# Altium schematic sheet PWM_Controller_Full_Bridge_TL494.SchDoc
size A0; SPICEModelCacheYQEDCYZF: <root> / <DocumentId>YQEDCYZF</DocumentId> / <CacheFrame Number="0"> / <Model Name="7850_744775147_47u" Kind="CKT"> / <Text>******* / .subckt 7850_744775147_47u 1 2 / Rp 1 2 40000 / Cp 1 2 4p / Rs 1 N3 0.1343 / L1 N3 2 47u / .ends 7850_744775147_47u</Text> / </Model> / <Model Name="7850_74477530_1m" Kind="CKT"> / <Text>******* / .subckt 7850_74477530_1m 1 2 / Rp 1 2 187304.915771 / Cp 1 2 4.36976277949p / Rs 1 N3 3.3 / L1 N3 2 1000u / .ends 7850_74477530_1m</Text> / </Model> / </CacheFrame> / </root>
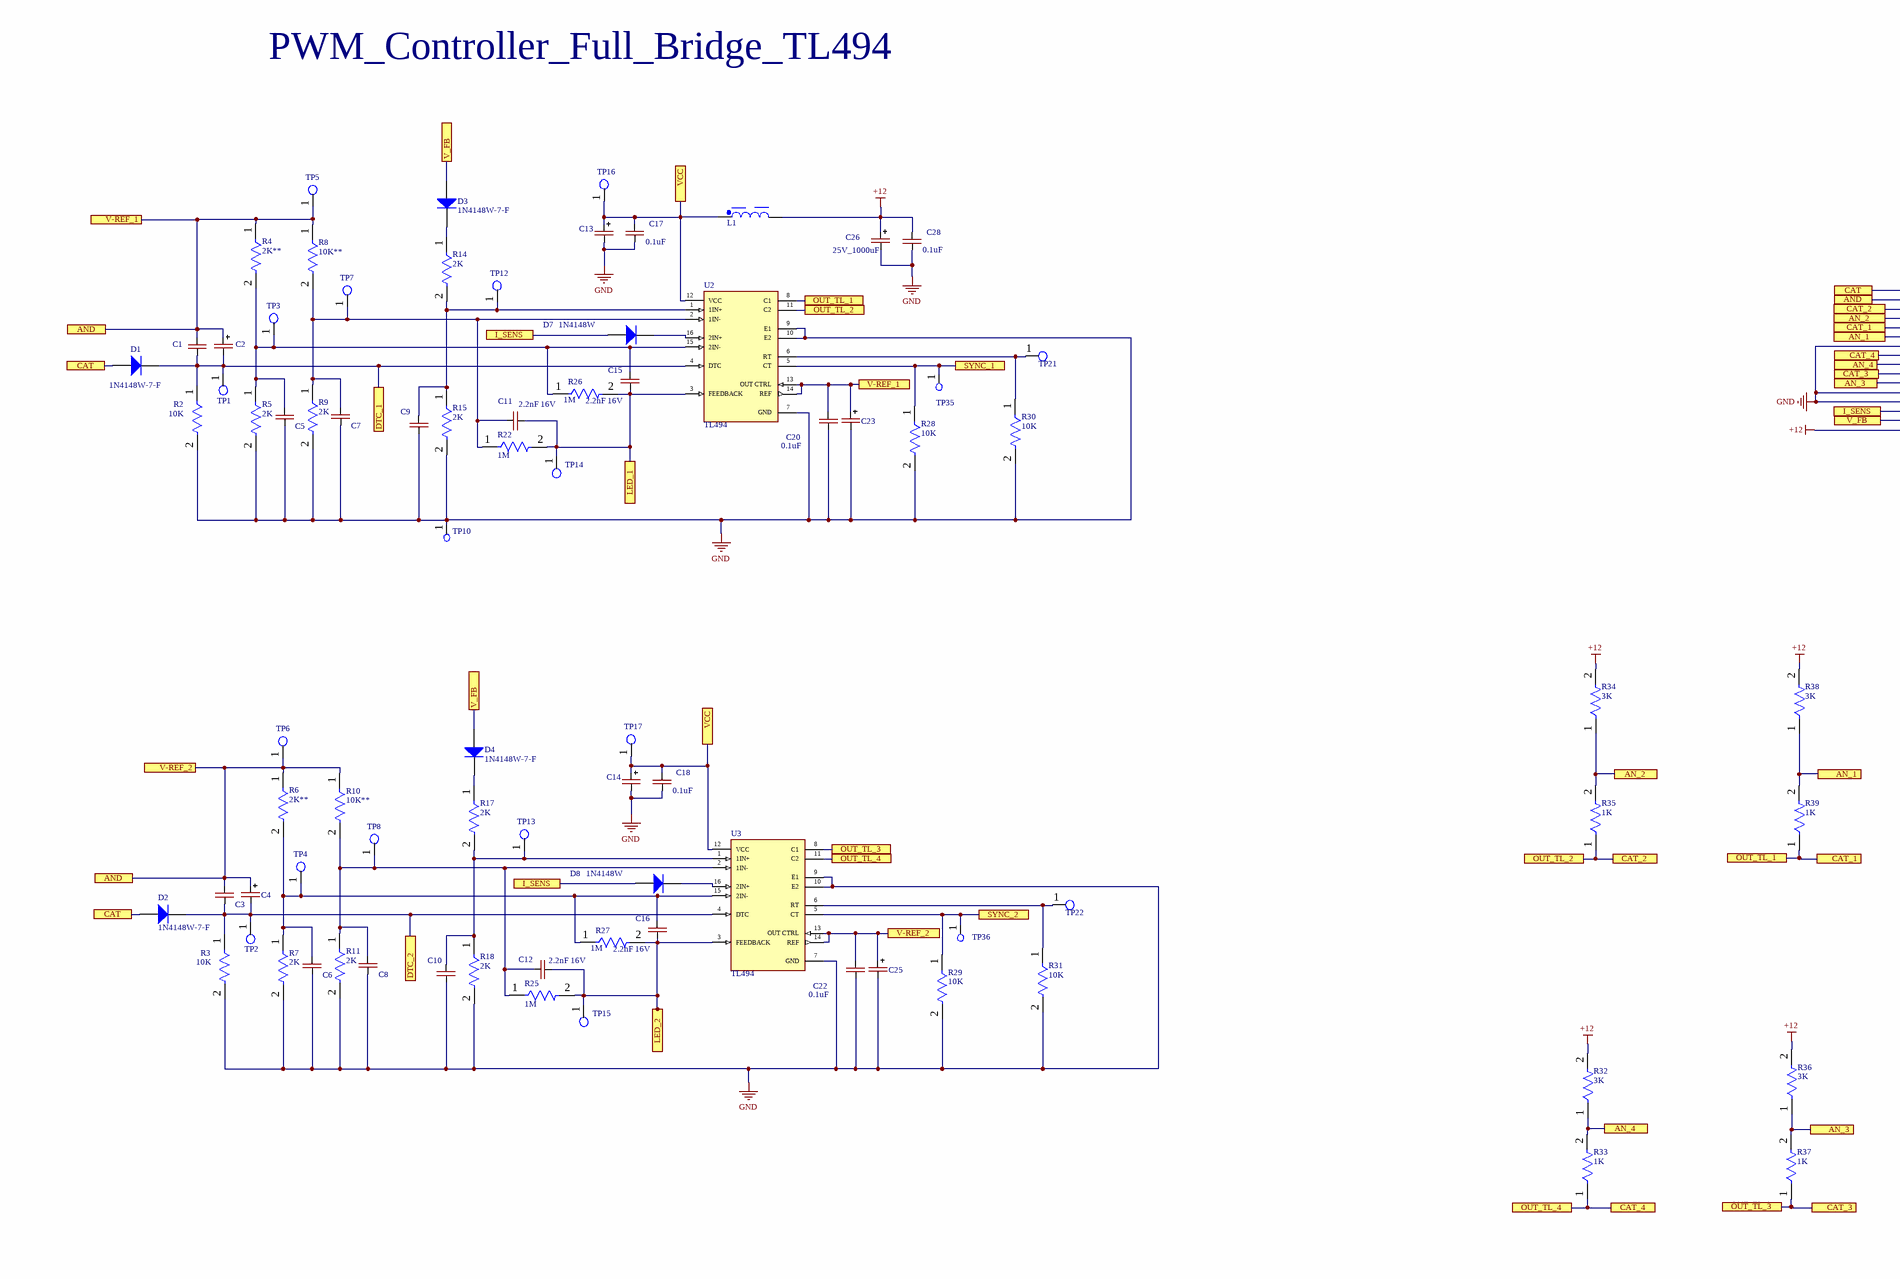
[diagram p0: PWM_Controller_Full_Bridge_TL494.SchDoc, top left]
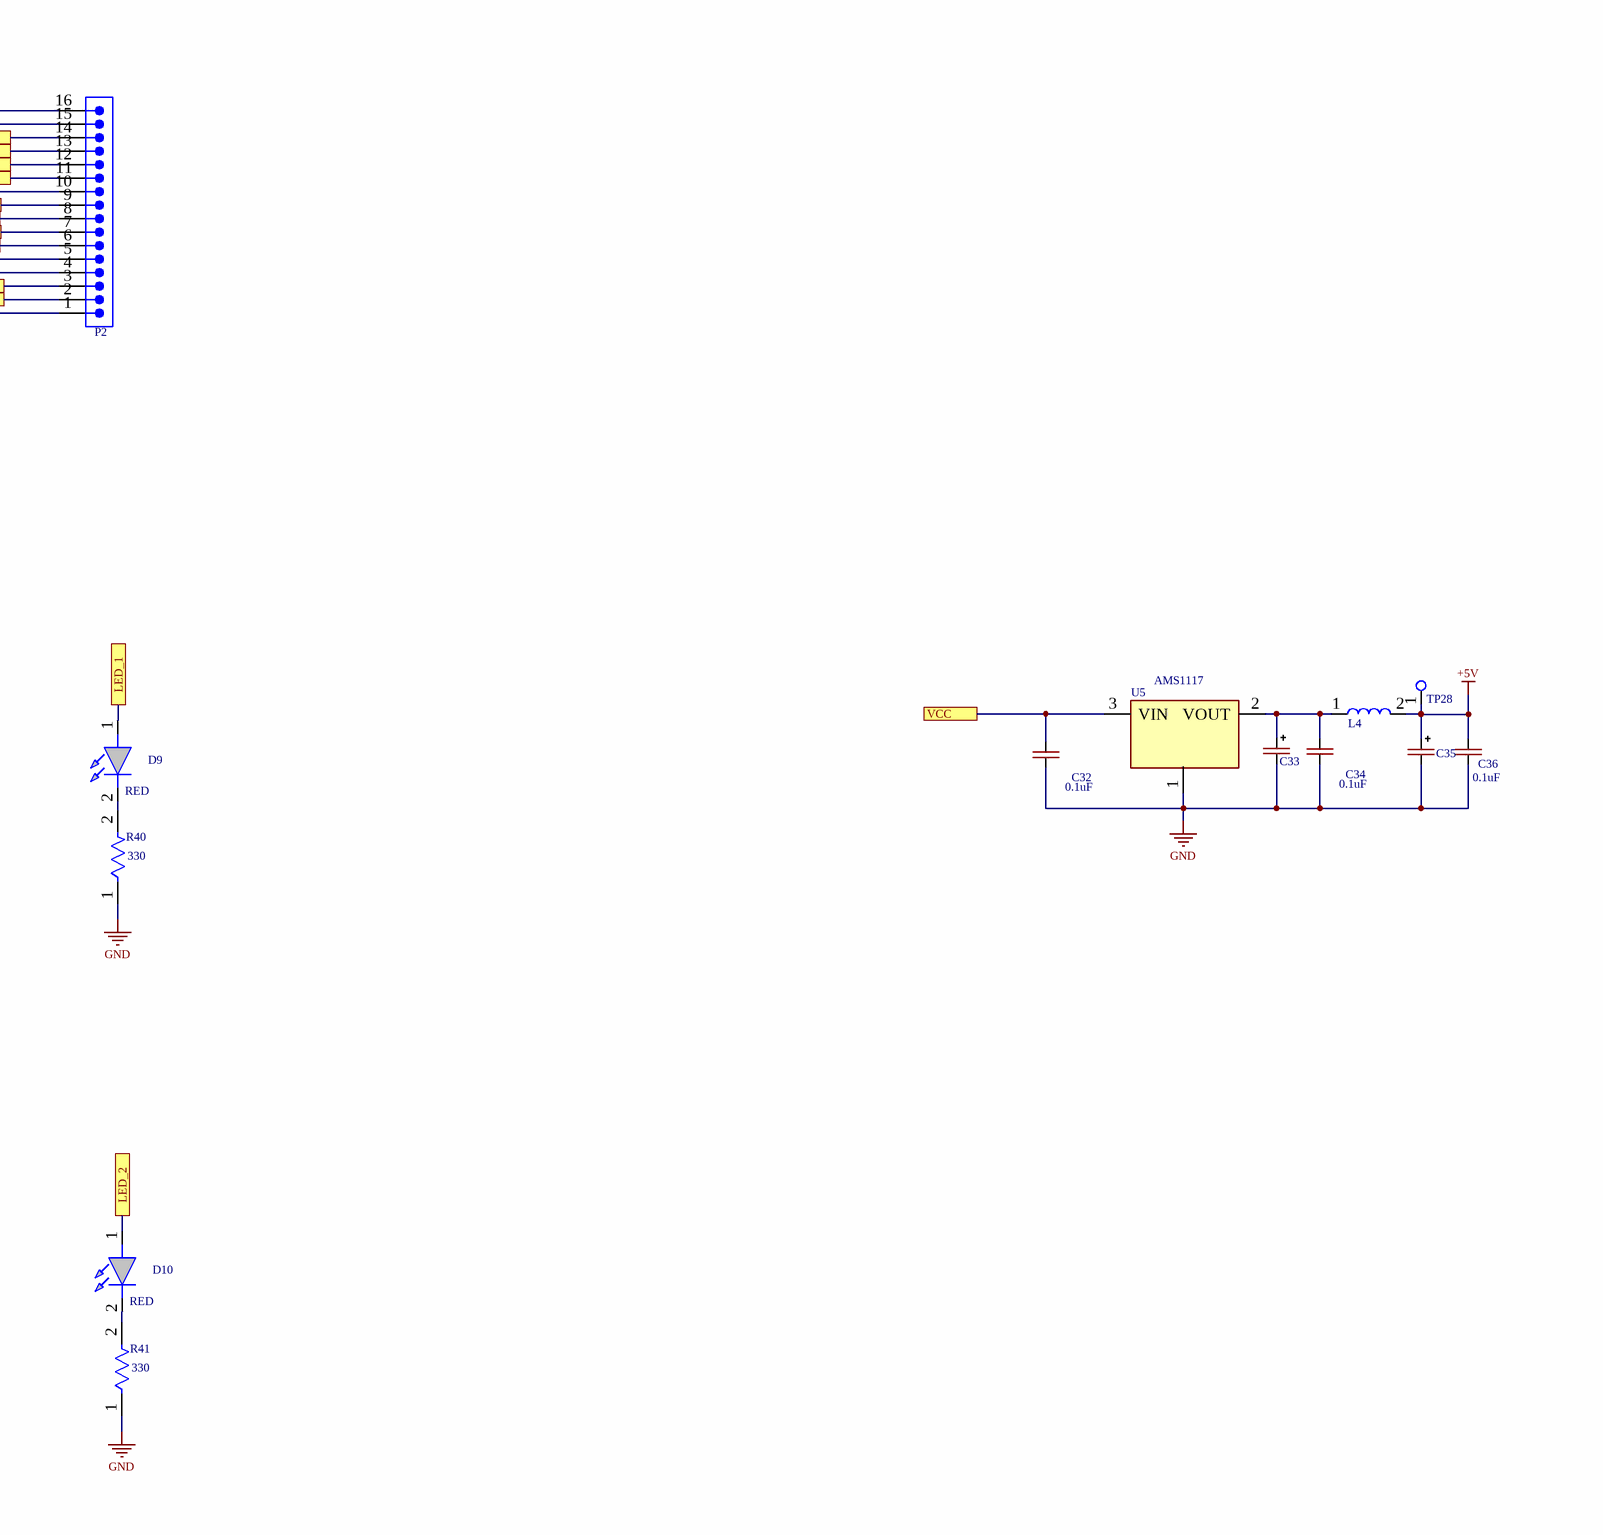
[diagram p1: PWM_Controller_Full_Bridge_TL494.SchDoc, top right]
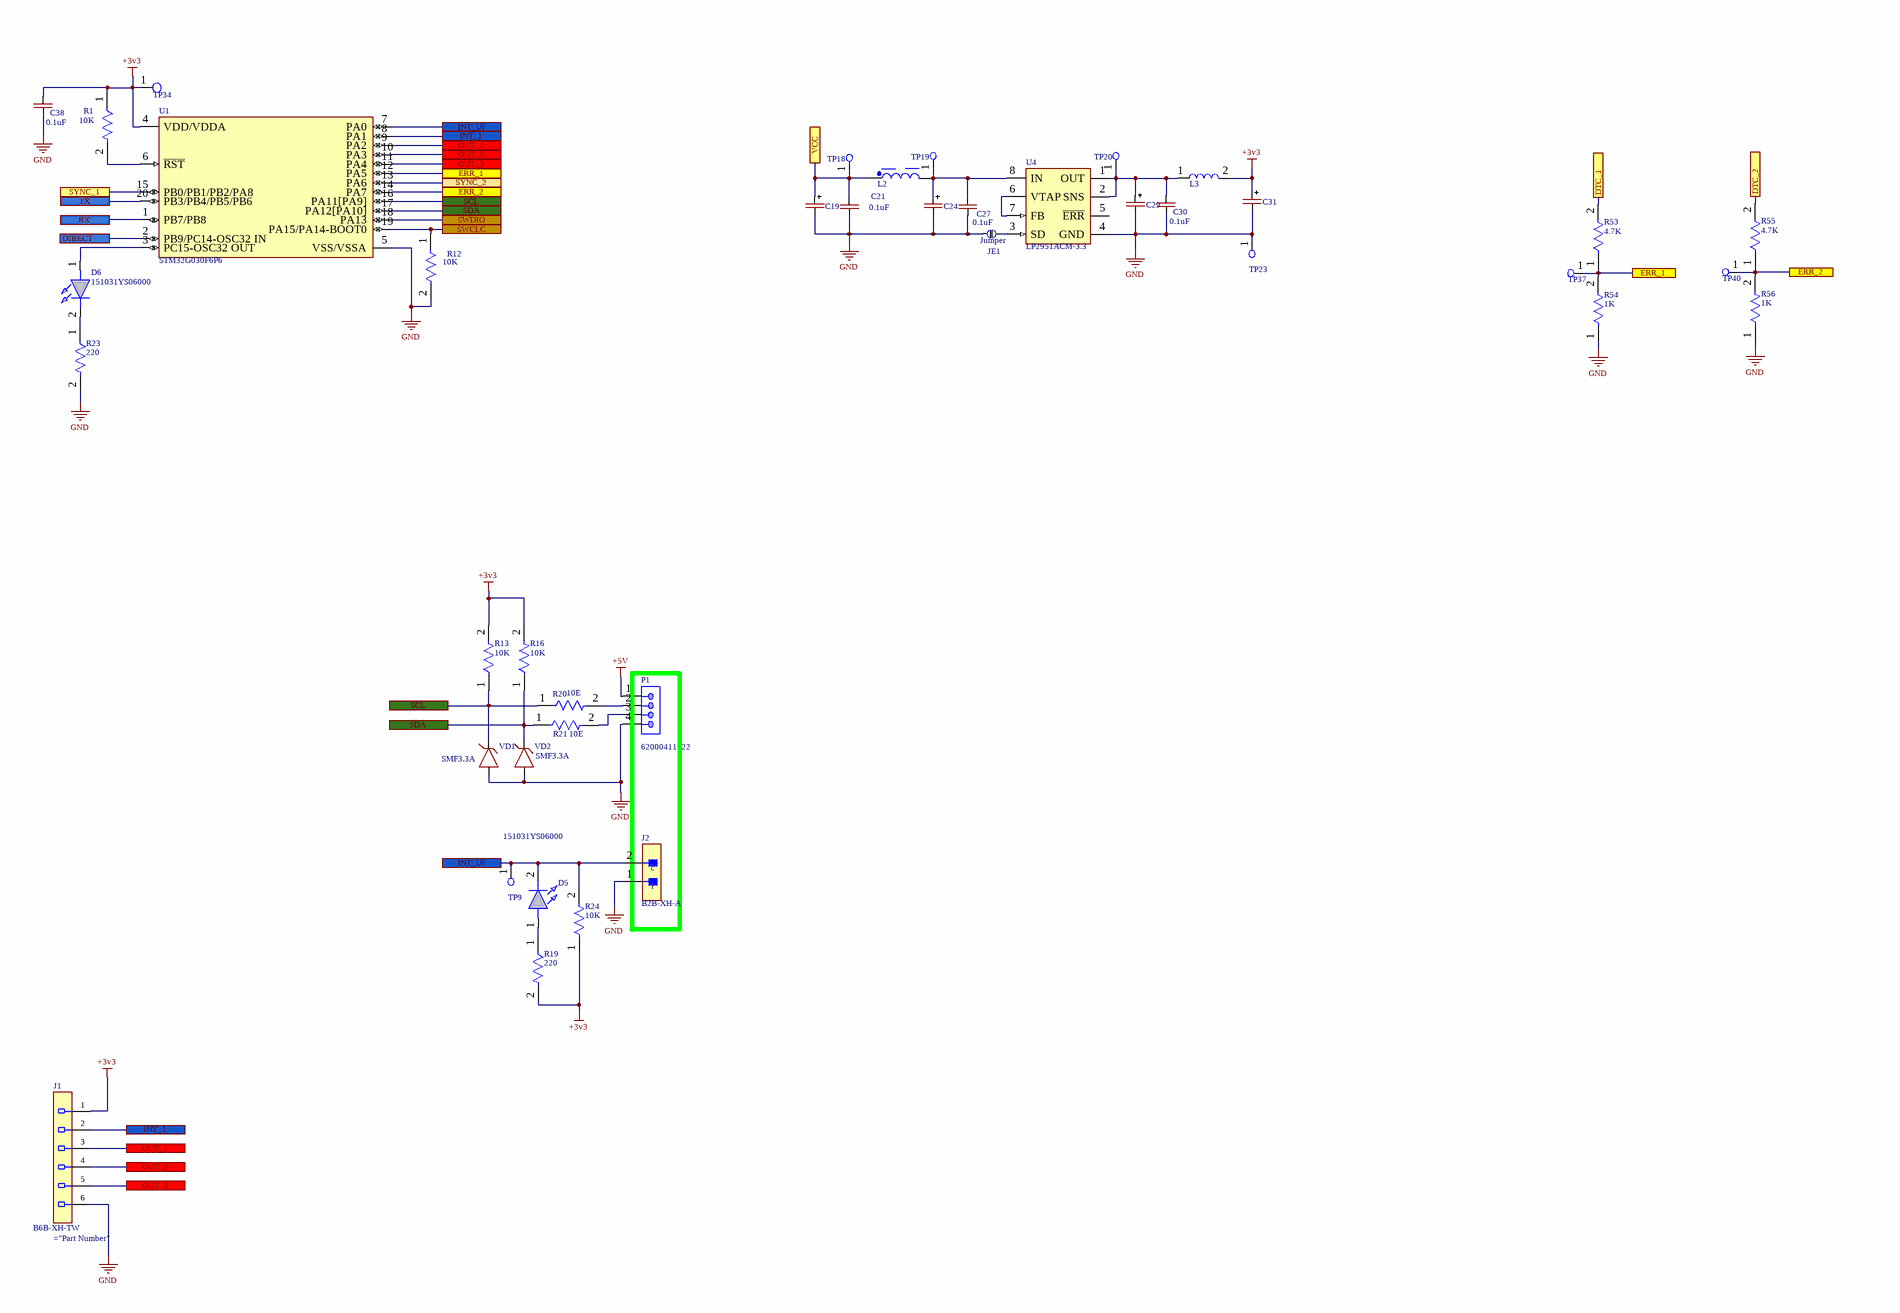
[diagram p2: PWM_Controller_Full_Bridge_TL494.SchDoc, bottom left]
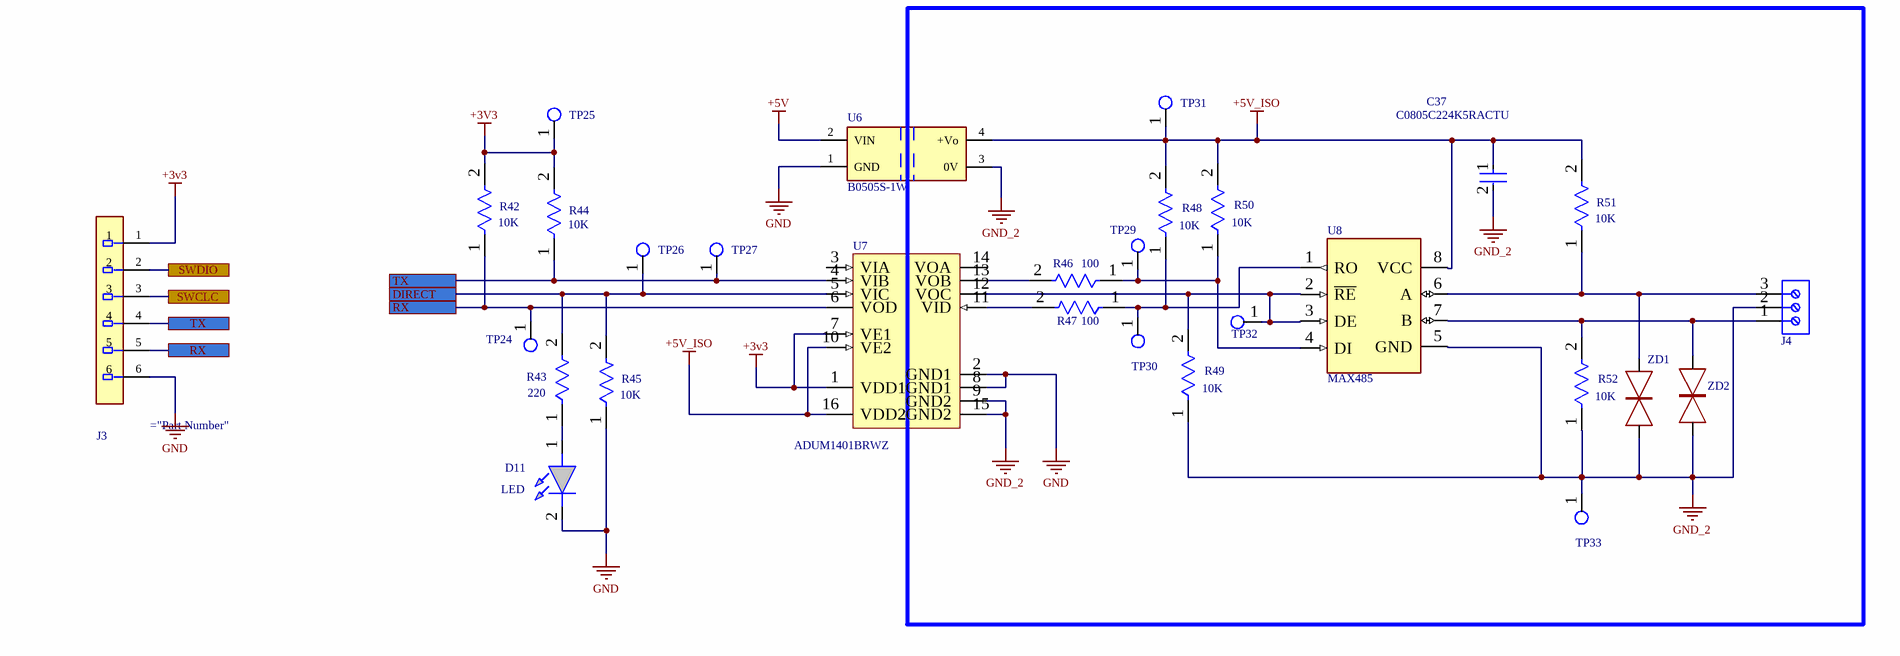
[diagram p3: PWM_Controller_Full_Bridge_TL494.SchDoc, bottom right]

## Parts
C1  CAP-NON-POLAR  [CAP-0805]  (value not drawn)
C2  CAP-POLAR  [CAP-TAN-D]  (value not drawn)
C3  CAP-NON-POLAR  [CAP-0805]  (value not drawn)
C4  CAP-POLAR  [CAP-TAN-D]  (value not drawn)
C5  CAP-NON-POLAR  [CAP-0805]  (value not drawn)
C6  CAP-NON-POLAR  [CAP-0805]  (value not drawn)
C7  CAP-NON-POLAR  [CAP-0805]  (value not drawn)
C8  CAP-NON-POLAR  [CAP-0805]  (value not drawn)
C9  CAP-NON-POLAR  [CAP-0805]  (value not drawn)
C10  CAP-NON-POLAR  [CAP-0805]  (value not drawn)
C11  2.2nF 16V  [CAP-0805]
C12  2.2nF 16V  [CAP-0805]
C13  CAP-POLAR  [CAP_SMD_Size_E]  (value not drawn)
C14  CAP-POLAR  [CAP_SMD_Size_E]  (value not drawn)
C15  2.2nF 16V  [CAP-0805]
C16  2.2nF 16V  [CAP-0805]
C17  0.1uF  [CAP-0805]
C18  0.1uF  [CAP-0805]
C19  CAP-POLAR  [CAP_SMD_Size_E]  (value not drawn)
C20  0.1uF  [CAP-0805]
C21  0.1uF  [CAP-0805]
C22  0.1uF  [CAP-0805]
C23  CAP-POLAR  [CAP-TAN-D]  (value not drawn)
C24  CAP-POLAR  [CAP_SMD_Size_E]  (value not drawn)
C25  CAP-POLAR  [CAP-TAN-D]  (value not drawn)
C26  25V_1000uF  [CAP_SMD_SIZE_H]
C27  0.1uF  [CAP-0805]
C28  0.1uF  [CAP-0805]
C29  CAP-POLAR  [CAP-TAN-D]  (value not drawn)
C30  0.1uF  [CAP-0805]
C31  CAP-POLAR  [CAP_SMD_Size_E]  (value not drawn)
C32  0.1uF  [CAP-0805]
C33  CAP-POLAR  [CAP_SMD_Size_E]  (value not drawn)
C34  0.1uF  [CAP-0805]
C35  CAP-POLAR  [CAP_SMD_Size_E]  (value not drawn)
C36  0.1uF  [CAP-0805]
C37  C0805C224K5RACTU  [FP-C0805C-DN-MFG]
C38  0.1uF  [CAP-0805]
D1  1N4148W-7-F  [DIOD-SOD123-2_V]
D2  1N4148W-7-F  [DIOD-SOD123-2_V]
D3  1N4148W-7-F  [DIOD-SOD123-2_V]
D4  1N4148W-7-F  [DIOD-SOD123-2_V]
D5  151031YS06000  [LED_RED]
D6  151031YS06000  [LED_RED]
D7  1N4148W  [DIOD-SOD123-2_V]
D8  1N4148W  [DIOD-SOD123-2_V]
D9  RED  [LED_RED]
D10  RED  [LED_RED]
D11  LED  [LED_BLUE]
J1  B6B-XH-TW  [B6B-XH-TW]
J2  B2B-XH-A  [B2B-XH-A]
J3  SWR25X-NRTC-S06-ST-BA  [Sullins_SWR25X-NRTC-S06-ST-BA_MFG]  (value not drawn)
J4  (no value)  [691101710003]
JE1  Jumper  [JE]
L1  47µH, 1.17A  [WE-PD2_7850]  (value not drawn)
L2  1000µH, 0.3A  [WE-PD2_7850]  (value not drawn)
L3  Coil  [Coil_4.5x4.5_mm]  (value not drawn)
L4  Coil  [Coil_4.5x4.5_mm]  (value not drawn)
P1  62000411622  [62000411622]
P2  61301611021  [61301611021]  (value not drawn)
R1  10K  [RES-0805]
R2  10K  [RES-0805]
R3  10K  [RES-0805]
R4  2K**  [RES-0805]
R5  2K  [RES-0805]
R6  2K**  [RES-0805]
R7  2K  [RES-0805]
R8  10K**  [RES-0805]
R9  2K  [RES-0805]
R10  10K**  [RES-0805]
R11  2K  [RES-0805]
R12  10K  [RES-0805]
R13  10K  [RES-0805]
R14  2K  [RES-0805]
R15  2K  [RES-0805]
R16  10K  [RES-0805]
R17  2K  [RES-0805]
R18  2K  [RES-0805]
R19  220  [RES-0805]
R20  10E  [RES-0805]
R21  10E  [RES-0805]
R22  1M  [RES-0805]
R23  220  [RES-0805]
R24  10K  [RES-0805]
R25  1M  [RES-0805]
R26  1M  [RES-0805]
R27  1M  [RES-0805]
R28  10K  [RES-0805]
R29  10K  [RES-0805]
R30  10K  [RES-0805]
R31  10K  [RES-0805]
R32  3K  [RES-0805]
R33  1K  [RES-0805]
R34  3K  [RES-0805]
R35  1K  [RES-0805]
R36  3K  [RES-0805]
R37  1K  [RES-0805]
R38  3K  [RES-0805]
R39  1K  [RES-0805]
R40  330  [RES-0805]
R41  330  [RES-0805]
R42  10K  [RES-0805]
R43  220  [RES-0805]
R44  10K  [RES-0805]
R45  10K  [RES-0805]
R46  100  [RES-0805]
R47  100  [RES-0805]
R48  10K  [RES-0805]
R49  10K  [RES-0805]
R50  10K  [RES-0805]
R51  10K  [RES-0805]
R52  10K  [RES-0805]
R53  4.7K  [RES-0805]
R54  1K  [RES-0805]
R55  4.7K  [RES-0805]
R56  1K  [RES-0805]
TP1  (no value)  [Test_Point]
TP2  (no value)  [Test_Point]
TP3  (no value)  [Test_Point]
TP4  (no value)  [Test_Point]
TP5  (no value)  [Test_Point]
TP6  (no value)  [Test_Point]
TP7  (no value)  [Test_Point]
TP8  (no value)  [Test_Point]
TP9  Test_Point_PCB  [Test_Point]  (value not drawn)
TP10  Test_Point_PCB  [Pin_Test_Point(Pink)]  (value not drawn)
TP12  (no value)  [Test_Point]
TP13  (no value)  [Test_Point]
TP14  (no value)  [Test_Point]
TP15  (no value)  [Test_Point]
TP16  (no value)  [Test_Point]
TP17  (no value)  [Test_Point]
TP18  Test_Point_PCB  [Test_Point]  (value not drawn)
TP19  Test_Point_PCB  [Test_Point]  (value not drawn)
TP20  Test_Point_PCB  [Test_Point]  (value not drawn)
TP21  (no value)  [Test_Point]
TP22  (no value)  [Test_Point]
TP23  Test_Point_PCB  [Pin_Test_Point(Orange)]  (value not drawn)
TP24  Test_Point_PCB  [Test_Point]  (value not drawn)
TP25  (no value)  [Test_Point]
TP26  Test_Point_PCB  [Test_Point]  (value not drawn)
TP27  Test_Point_PCB  [Test_Point]  (value not drawn)
TP28  Test_Point_PCB  [Test_Point]  (value not drawn)
TP29  Test_Point_PCB  [Test_Point]  (value not drawn)
TP30  (no value)  [Test_Point]
TP31  Test_Point_PCB  [Test_Point]  (value not drawn)
TP32  Test_Point_PCB  [Test_Point]  (value not drawn)
TP33  Test_Point_PCB  [Test_Point]  (value not drawn)
TP34  (no value)  [Test_Point]
TP35  Test_Point_PCB  [Test_Point]  (value not drawn)
TP36  Test_Point_PCB  [Test_Point]  (value not drawn)
TP37  Test_Point_PCB  [Test_Point]  (value not drawn)
TP40  Test_Point_PCB  [Test_Point]  (value not drawn)
U1  STM32G030F6P6  [FP-TSSOP20-YA-IPC_A]
U2  TL494  [SOIC-16-M]
U3  TL494  [SOIC-16-M]
U4  LP2951ACM-3.3  [D0008A_N]
U5  AMS1117  [SOT-223]
U6  B0505S-1W  [B0505S-1W]
U7  ADUM1401BRWZ  [ADI-RW-16_M]
U8  MAX485  [SOIC-8-MFG]
VD1  SMF3.3A  [SMF3.3A]
VD2  SMF3.3A  [SMF3.3A]
ZD1  P6SMB16CA  [DO-214AA]  (value not drawn)
ZD2  P6SMB16CA  [DO-214AA]  (value not drawn)

## Ports
AN_1, AN_2, AN_3, AN_4, AND, CAT, CAT_1, CAT_2, CAT_3, CAT_4, DIRECT, DTC_1, DTC_2, ERR_1, ERR_2, I_SENS, INT_1, INT_UI, LED_1, LED_2, OUT_1, OUT_2, OUT_3, OUT_TL_1, OUT_TL_2, OUT_TL_3, OUT_TL_4, RX, SCL, SDA, SWCLC, SWDIO, SYNC_1, SYNC_2, TX, V-REF_1, V-REF_2, V_FB, VCC

## Nets
+3v3: C31.1(+) C38.2 J1.1 J3.1 L3.2 R1.1 R13.2 R16.2 R19.2 R24.1 R42.2 R44.2 TP25.1(G9) TP34.1(G9) U1.4(VDD/VDDA) U7.1(VDD1) U7.7(VE1)
+5V: C35.1(+) C36.2 L4.2 P1.1 TP28.1(G9) U6.2(VIN)
+5V_ISO: C37.1 R48.2 R50.2 R51.2 TP31.1(G9) U6.4(+Vo) U7.10(VE2) U7.16(VDD2) U8.8(VCC)
+12: C26.1(+) C28.2 L1.2 P2.1 R32.2 R34.2 R36.2 R38.2
GND: C5.1 C6.1 C7.1 C8.1 C9.1 C10.1 C13.2(-) C14.2(-) C17.1 C18.1 C19.2(-) C20.1 C21.1 C22.1 C23.2(-) C24.2(-) C25.2(-) C26.2(-) C27.1 C28.1 C29.2(-) C30.1 C31.2(-) C32.1 C33.2(-) C34.1 C35.2(-) C36.1 C38.1 D11.2(K) J1.6 J2.1 J3.6 JE1.2 P1.4 P2.4 P2.5 P2.10 R2.2 R3.2 R5.2 R7.2 R9.2 R11.2 R12.2 R15.2 R18.2 R23.2 R28.2 R29.2 R30.2 R31.2 R40.1 R41.1 R45.1 R54.1 R56.1 TP10.1(G9) TP23.1(G9) U1.5(VSS/VSSA) U2.7(GND) U2.9(E1) U2.10(E2) U3.7(GND) U3.9(E1) U3.10(E2) U4.4(GND) U5.1(Ground) U6.1(GND) U7.2(GND1) U7.8(GND1) VD1.1(A) VD2.1(A)
GND_2: C37.2 J4.2 R49.1 R52.1 TP33.1(G9) U6.3(0V) U7.9(GND2) U7.15(GND2) U8.5(GND) ZD1.1(A) ZD2.1(A)
AN_1: P2.11 R38.1 R39.2 ; port AN_1
AN_2: P2.13 R34.1 R35.2 ; port AN_2
AN_3: P2.6 R36.1 R37.2 ; port AN_3
AN_4: P2.8 R32.1 R33.2 ; port AN_4
AND: C1.2 C2.1(+) C3.2 C4.1(+) C20.2 C22.2 C23.1(+) C25.1(+) P2.15 R4.1 R6.1 R8.1 R10.1 TP5.1(G9) TP6.1(G9) U2.13(OUT_CTRL) U2.14(REF) U3.13(OUT_CTRL) U3.14(REF) ; port V-REF_1, port AND, port V-REF_2
CAT: D1.2(A) D2.2(A) P2.16 ; port CAT
CAT_1: P2.12 R39.1 U2.8(C1) ; port OUT_TL_1, port CAT_1
CAT_2: P2.14 R35.1 U2.11(C2) ; port OUT_TL_2, port CAT_2
CAT_3: P2.7 R37.1 U3.8(C1) ; port CAT_3, port OUT_TL_3
CAT_4: P2.9 R33.1 U3.11(C2) ; port CAT_4, port OUT_TL_4
DIRECT: R43.2 R45.2 TP26.1(G9) U1.2(PB9/PC14-OSC32_IN) U7.5(VIC) ; port DIRECT
DTC_1: C1.1 C2.2(-) D1.1(K) R2.1 R53.2 TP1.1(G9) U2.4(DTC) ; port DTC_1
DTC_2: C3.1 C4.2(-) D2.1(K) R3.1 R55.2 TP2.1(G9) U3.4(DTC) ; port DTC_2
ERR_1: R53.1 R54.2 TP37.1(G9) U1.12(PA5) ; port ERR_1
ERR_2: R55.1 R56.2 TP40.1(G9) U1.14(PA7) ; port ERR_2
I_SENS: D7.2(A) D8.2(A) P2.3 ; port I_SENS
INT_1: J1.2 U1.8(PA1) ; port INT_1
INT_UI: D5.2(K) J2.2 R24.2 TP9.1(G9) U1.7(PA0) ; port INT_UI
LED_1: C11.1 C15.1 D9.1(A) R22.2 R26.2 TP14.1(G9) U2.3(FEEDBACK) ; port LED_1
LED_2: C12.1 C16.1 D10.1(A) R25.2 R27.2 TP15.1(G9) U3.3(FEEDBACK) ; port LED_2
OUT_1: J1.3 U1.9(PA2) ; port OUT_1
OUT_2: J1.4 U1.10(PA3) ; port OUT_2
OUT_3: J1.5 U1.11(PA4) ; port OUT_3
RX: J3.5 R42.1 TP24.1(G9) U1.1(PB7/PB8) U7.6(VOD) ; port RX
SCL: R13.1 R20.1 U1.16(PA11[PA9]) VD1.2(C) ; port SCL
SDA: R16.1 R21.1 U1.17(PA12[PA10]) VD2.2(C) ; port SDA
SWCLC: J3.3 R12.1 U1.19(PA15/PA14-BOOT0) ; port SWCLC
SWDIO: J3.2 U1.18(PA13) ; port SWDIO
SYNC_1: R28.1 TP35.1(G9) U1.15(PB0/PB1/PB2/PA8) U2.5(CT) ; port SYNC_1
SYNC_2: R29.1 TP36.1(G9) U1.13(PA6) U3.5(CT) ; port SYNC_2
TX: J3.4 R44.1 TP27.1(G9) U1.20(PB3/PB4/PB5/PB6) U7.4(VIB) ; port TX
V_FB: D3.2(A) D4.2(A) P2.2 ; port V_FB
VCC: C13.1(+) C14.1(+) C17.2 C18.2 C19.1(+) C21.2 C32.2 L1.1 L2.1 TP16.1(G9) TP17.1(G9) TP18.1(G9) U2.12(VCC) U3.12(VCC) U5.3(VIN) ; port VCC
NetC5_2: C5.2 C15.2 R4.2 R5.1 R26.1 TP3.1(G9) U2.15(2IN-)
NetC6_2: C6.2 C16.2 R6.2 R7.1 R27.1 TP4.1(G9) U3.15(2IN-)
NetC7_2: C7.2 C11.2 R8.2 R9.1 R22.1 TP7.1(G9) U2.2(1IN-)
NetC8_2: C8.2 C12.2 R10.2 R11.1 R25.1 TP8.1(G9) U3.2(1IN-)
NetC9_2: C9.2 R14.2 R15.1 TP12.1(G9) U2.1(1IN+)
NetC10_2: C10.2 R17.2 R18.1 TP13.1(G9) U3.1(1IN+)
NetC24_1: C24.1(+) C27.2 L2.2 TP19.1(G9) U4.8(IN)
NetC29_1: C29.1(+) C30.2 L3.1 TP20.1(G9) U4.1(OUT) U4.2(SNS)
NetC33_1: C33.1(+) C34.2 L4.1 U5.2(VOUT)
NetD3_1: D3.1(K) R14.1
NetD4_1: D4.1(K) R17.1
NetD5_1: D5.1(A) R19.1
NetD6_1: D6.1(A) U1.3(PC15-OSC32_OUT)
NetD6_2: D6.2(K) R23.1
NetD7_1: D7.1(K) U2.16(2IN+)
NetD8_1: D8.1(K) U3.16(2IN+)
NetD9_2: D9.2(K) R40.2
NetD10_2: D10.2(K) R41.2
NetD11_1: D11.1(A) R43.1
NetJ4_1: J4.1 R52.2 U8.7(B) ZD2.2(A)
NetJ4_3: J4.3 R51.1 U8.6(A) ZD1.2(A)
NetJE1_1: JE1.1 U4.3(SD)
NetP1_2: P1.2 R20.2
NetP1_3: P1.3 R21.2
NetR1_2: R1.2 U1.6(~{RST})
NetR30_1: R30.1 TP21.1(G9) U2.6(RT)
NetR31_1: R31.1 TP22.1(G9) U3.6(RT)
NetR46_1: R46.1 R50.1 TP29.1(G9) U8.4(DI)
NetR46_2: R46.2 U7.13(VOB)
NetR47_1: R47.1 R48.1 TP30.1(G9) U8.1(RO)
NetR47_2: R47.2 U7.11(VID)
NetR49_2: R49.2 TP32.1(G9) U7.12(VOC) U8.2(~{RE}) U8.3(DE)
NetU4_6: U4.6(VTAP) U4.7(FB)

Not connected (* = marked no-connect by the designer): U4 5(~{ERR}); U7 3(VIA) 14(VOA)

## Notes on the sheet
- PWM_Controller_Full_Bridge_TL494

## Library data of the parts
C11 C12 C15-C18 C20-C22 C27 C28 C30 C32 C34 C36 C38 = CAP-NON-POLAR
C26 = CAP_POL_SMD
C37 = CMP-1036-04552-2: CAP CER 0.22UF 50V X7R 0805; Manufacturer: KEMET; Value: 0.22 μF; Temperature Coefficient: 30ppm/°C; Material: Ceramic; Tolerance: 0.1; ComponentLink2URL: https://content.kemet.com/datasheets/KEM_C1003_C0G_SMD.pdf; Temperature Characteristic: X7R; Device Class L3: Ceramic Capacitors; Lead Free: Yes; Temperature: -55°C to +125°C; RoHS: TRUE; Capacitance: 0.22 μF; Automotive: No; Octopart: https://octopart.com/c0805c224k5ractu-kemet-144670; Manufacturer Part Number: C0805C224K5RACTU; Temperature Range Low: -55°C; Height: 0.88mm; Device Class L1: Passive Components; Digikey Description: CAP CER 0.22UF 50V X7R 0805; ComponentLink2Description: Datasheet; Mouser Description: CAP CER 0.22UF 50V X7R 0805; Category: Cap; Ipc Land Pattern Name: CAPC200125X78; Temperature Range High: +125°C; Package: C0805C-DN; Device Class L2: Capacitors; Voltage Rating: 50 V
D1-D4 D7 D8 = 1N4148: Fast Switching Diode, 100 V, 0.15 A, -65 to 150 degC, 2-Pin?SOD123, RoHS, Tape and Reel; Recovery Time: 4ns; Brand: DiodesIncorporated; Unit Weight: 0.000353oz; Max Surge Current: 2A; Peak Reverse Voltage: 100V; Ir - Reverse Current: 1uA; Vf - Forward Voltage: 1.25V; Configuration: Single; If - Forward Current: 0.15A; Product Category: Diodes-GeneralPurpose,Power,Switching; Operating Temperature Range: -65Cto+150C; Packaging: Reel; Manufacturer URL: http://www.diodes.com/; Maximum Operating Temperature: +150C; Height: 1.25mm; Minimum Operating Temperature: -65C; Product: SwitchingDiodes; Package URL: http://www.diodes.com/datasheets/ds18004.pdf; Type: SwitchingDiode; Package Reference: SOD123-2; Width: 1.7mm; Datasheet URL: http://www.farnell.com/datasheets/1915529.pdf; Datasheet Version: Rev. 24-2, 10/2013; Series: 1N4148; Factory Pack Quantity: 3000; Length: 2.85mm; RoHS: True; Manufacturer: DiodesIncorporated; Mounting Style: SMD/SMT; Package / Case: SOD-123
D5 D6 D9-D11 = LED: WURTH ELEKTRONIK - 151031YS06000 - LED, Yellow, Through Hole, T-1 (3mm), 30 mA, 2 V, 590 nm; Geometry.Height: 5.5mm; Manufacturer_Name: Wurth Elektronik; Manufacturer_Part_Number: 151031YS06000; Mouser Part Number: 710-151031YS06000; Mouser Price/Stock: https://www.mouser.co.uk/ProductDetail/Wurth-Elektronik/151031YS06000?qs=LlUlMxKIyB3xSYYW%252BcuBiQ%3D%3D; Arrow Part Number: *; Arrow Price/Stock: *; Mouser Testing Part Number: *; Mouser Testing Price/Stock: *; Datasheet Link: https://katalog.we-online.de/led/datasheet/151031YS06000.pdf
J4 = 691101710003: WR-TBL Series 101 Horizontal Entry Modular, Through Hole, pitch 5mm, 3p; Manufacturer: Wurth Elektronik; Pin Number: 3; Rated Current: 16A; Working Voltage: 250V; PCB/Cable/Panel: PCB; Modularity: Yes; ComponentLink1Description: Manufacturer Link; ComponentLink1URL: https://www.we-online.com/redexpert/article/691101710003?ad; ComponentLink2Description: Datasheet; ComponentLink2URL: https://www.we-online.com/redexpert/spec/691101710003?ad; Category: Terminal Blocks; Match Code: WR-TBL; Manufacturer Part Number: 691101710003; Mount: Through Hole; Operating Temperature Max: 105°C; Operating Temperature Min: -40°C; Packaging: Box; Pitch: 5mm; Orientation: Horizontal; Application: Pressure Clamp
JE1 = JE
L1 = 744775147: WE-PD2 SMT Power Inductor, size 7850, 47µH, 1.17A, 0.18Ω; Manufacturer: Wurth Elektronik; Case/Size Code: 7850; DC Resistance: 0.134Ω; Saturation Current: 1.24A; Self Resonant Frequency: 12MHz; Manufacturer Part Number: 744775147; Category: Unshielded Power Inductors; Match Code: WE-PD2; ComponentLink1Description: Website Link; ComponentLink1URL: https://www.we-online.com/redexpert/article/744775147?ad; ComponentLink2Description: Datasheet Link; ComponentLink2URL: https://www.we-online.com/redexpert/spec/744775147?ad; Mount: Surface Mount; Operating Temperature Max: 125°C; Operating Temperature Min: -40°C; Packaging: Tape and Reel; Length: 7.8mm; Width: 7mm; Height: 4.95mm; DC Resistance Max: 0.18Ω; Inductance: 47µH; Rated Current: 1.17A
L2 = 74477530: WE-PD2 SMT Power Inductor, size 7850, 1000µH, 0.3A, 3.3Ω; Manufacturer: Wurth Elektronik; Case/Size Code: 7850; DC Resistance: 2.78Ω; Self Resonant Frequency: 2.4MHz; Manufacturer Part Number: 74477530; Category: Unshielded Power Inductors; Match Code: WE-PD2; ComponentLink1Description: Website Link; ComponentLink1URL: https://www.we-online.com/redexpert/article/74477530?ad; ComponentLink2Description: Datasheet Link; ComponentLink2URL: https://www.we-online.com/redexpert/spec/74477530?ad; Mount: Surface Mount; Operating Temperature Max: 125°C; Operating Temperature Min: -40°C; Packaging: Tape and Reel; Length: 7.8mm; Width: 7mm; Height: 4.95mm; DC Resistance Max: 3.3Ω; Inductance: 1000µH; Rated Current: 0.3A; Saturation Current: 0.3A
P1 = 62000411622: WR-WTB Male Vertical Shrouded Header, pitch 2mm, 4p; Pin Number: 4; Contact Resistance: 20mOhm; Rated Current: 2A; Withstanding Voltage: 800VAC; Working Voltage: 125VAC; ComponentLink1Description: Manufacturer; ComponentLink1URL: http://www.we-online.de; ComponentLink2Description: Datasheet; ComponentLink2URL: https://www.we-online.com/catalog/datasheet/62000411622.pdf; Pitch: 2mm; Published Date: January 2020; Publisher: Wurth Elektronik; Mounting Technology: THT; Packaging: Bag; Operating Temperature: -25 to +85degC; Part Number: 62000411622; Gender: Male; Type: Vertical
P2 = 61301611021: WR-PHD Pin Header, THT, Angled, pitch 2.54mm, 1 Row, 16P; Manufacturer: Wurth Elektronik; Contact Resistance: 20mΩ; Rated Current: 3A; Working Voltage: 250V; Withstanding Voltage: 500V; ComponentLink1Description: Website Link; ComponentLink1URL: https://www.we-online.com/redexpert/article/61301611021?ad; ComponentLink2Description: Datasheet Link; ComponentLink2URL: https://www.we-online.com/redexpert/spec/61301611021?ad; Manufacturer Part Number: 61301611021; Category: Board-to-Board Connectors; Match Code: WR-PHD; Mount: Through Hole; Operating Temperature Max: 105°C; Operating Temperature Min: -40°C; Packaging: Bag; Gender: Pin Header; Number of Pins: 16; Number of Rows: 1; Orientation: Angled; Pitch: 2.54mm
R1-R3 R5 R7 R9 R11-R56 = RES-CONST
R4 R6 = RES-CONST: 2K
R8 R10 = RES-CONST: 10K
TP1-TP10 TP12-TP37 TP40 = TP_PCB?: Test_Point
U1 = STM32G030F6P6: SOIC-20
U2 U3 = TL494: TL494 Pwm controller
U4 = CMP-0062-01032-3: Series of Adjustable Micropower Voltage Regulators, 8-pin Narrow SOIC; Manufacturer: Texas Instruments; CompType: LDO IC; PowerWise: N; PackageTopMarking: NSZXTT*2951A*CM33DD; PinCount: 8; PackageReference: D0008A; ComponentLink1Description: Datasheet URL; Code_JEDEC: MS-012-AA; Code_IPC: SOIC127P600-8; RoHS: N; ComponentLink1URL: http://www.ti.com/general/docs/lit/getliterature.tsp?genericPartNumber=LP2951-N&fileType=pdf; PackageDescription: SOIC Narrow, 4.9 x 3.9 x 1.45mm, 8 Lead, 1.27mm Pitch
U7 = CMP-0534-00565-1: Quad Channel Digital Isolator, 2.5 KV rms Insulation Rating, 10 Mbps Data Rate, 50 ns Delay, Industrial, 16-pin SOIC (RW-16), Tube; Manufacturer: Analog Devices; Max Data Rate: 10Mbps; ComponentLink2URL: http://www.analog.com/static/imported-files/data_sheets/ADuM1400_1401_1402.pdf; ComponentLink5Description: URL Link2; ComponentLink3URL: http://www.analog.com/static/imported-files/packages/PKG_PDF/SOIC_WIDE%20%28RW%29/RW_16.pdf; DatasheetVersion: Rev. H; ComponentLink2Description: Datasheet; ComponentLink3Description: Package Specification; PartNumber: ADUM1401BRWZ; ComponentLink5URL: Reference Circuit:http://www.analog.com/en/interface-isolation/digital-isolators/adum1401/products/product.html#product-recommendations; Max Operating Temp (degreesC): 125; PackageReference: RW-16; PackageVersion: 032707-B, 03/2007; ComponentLink1Description: Manufacturer URL; Code_JEDEC: MS-013-AA; PackageDescription: 16-Pin Standard Small Outline Package, Body 10.3 x 7.5 mm, Pitch 1.27 mm; Mounting Technology: Surface Mount; ComponentLink1URL: http://www.analog.com/en/index.html; ComponentLink4Description: URL Link1; ComponentLink4URL: Product URL:http://www.analog.com/en/interface-isolation/digital-isolators/adum1401/products/product.html
VD1 VD2 = ESD_Unidirect